# Altium schematic sheet Scooter - Primary Board - Schematic.SchDoc: PIC
size A3; PageSetup: Record=PageOptions|CenterHorizontal=True|CenterVertical=True|PrintScale=1.01|XCorrection=1.00|YCorrection=1.00|PrintKind=1|BorderSize=5000000|LeftOffset=0|BottomOffset=0|Orientation=2|PaperLength=1000|PaperWidth=1000|Scale=100|PaperSource=15|PrintQuality=600|MediaType=1|DitherType=10|PaperKind=A3|PrintScaleMode=1
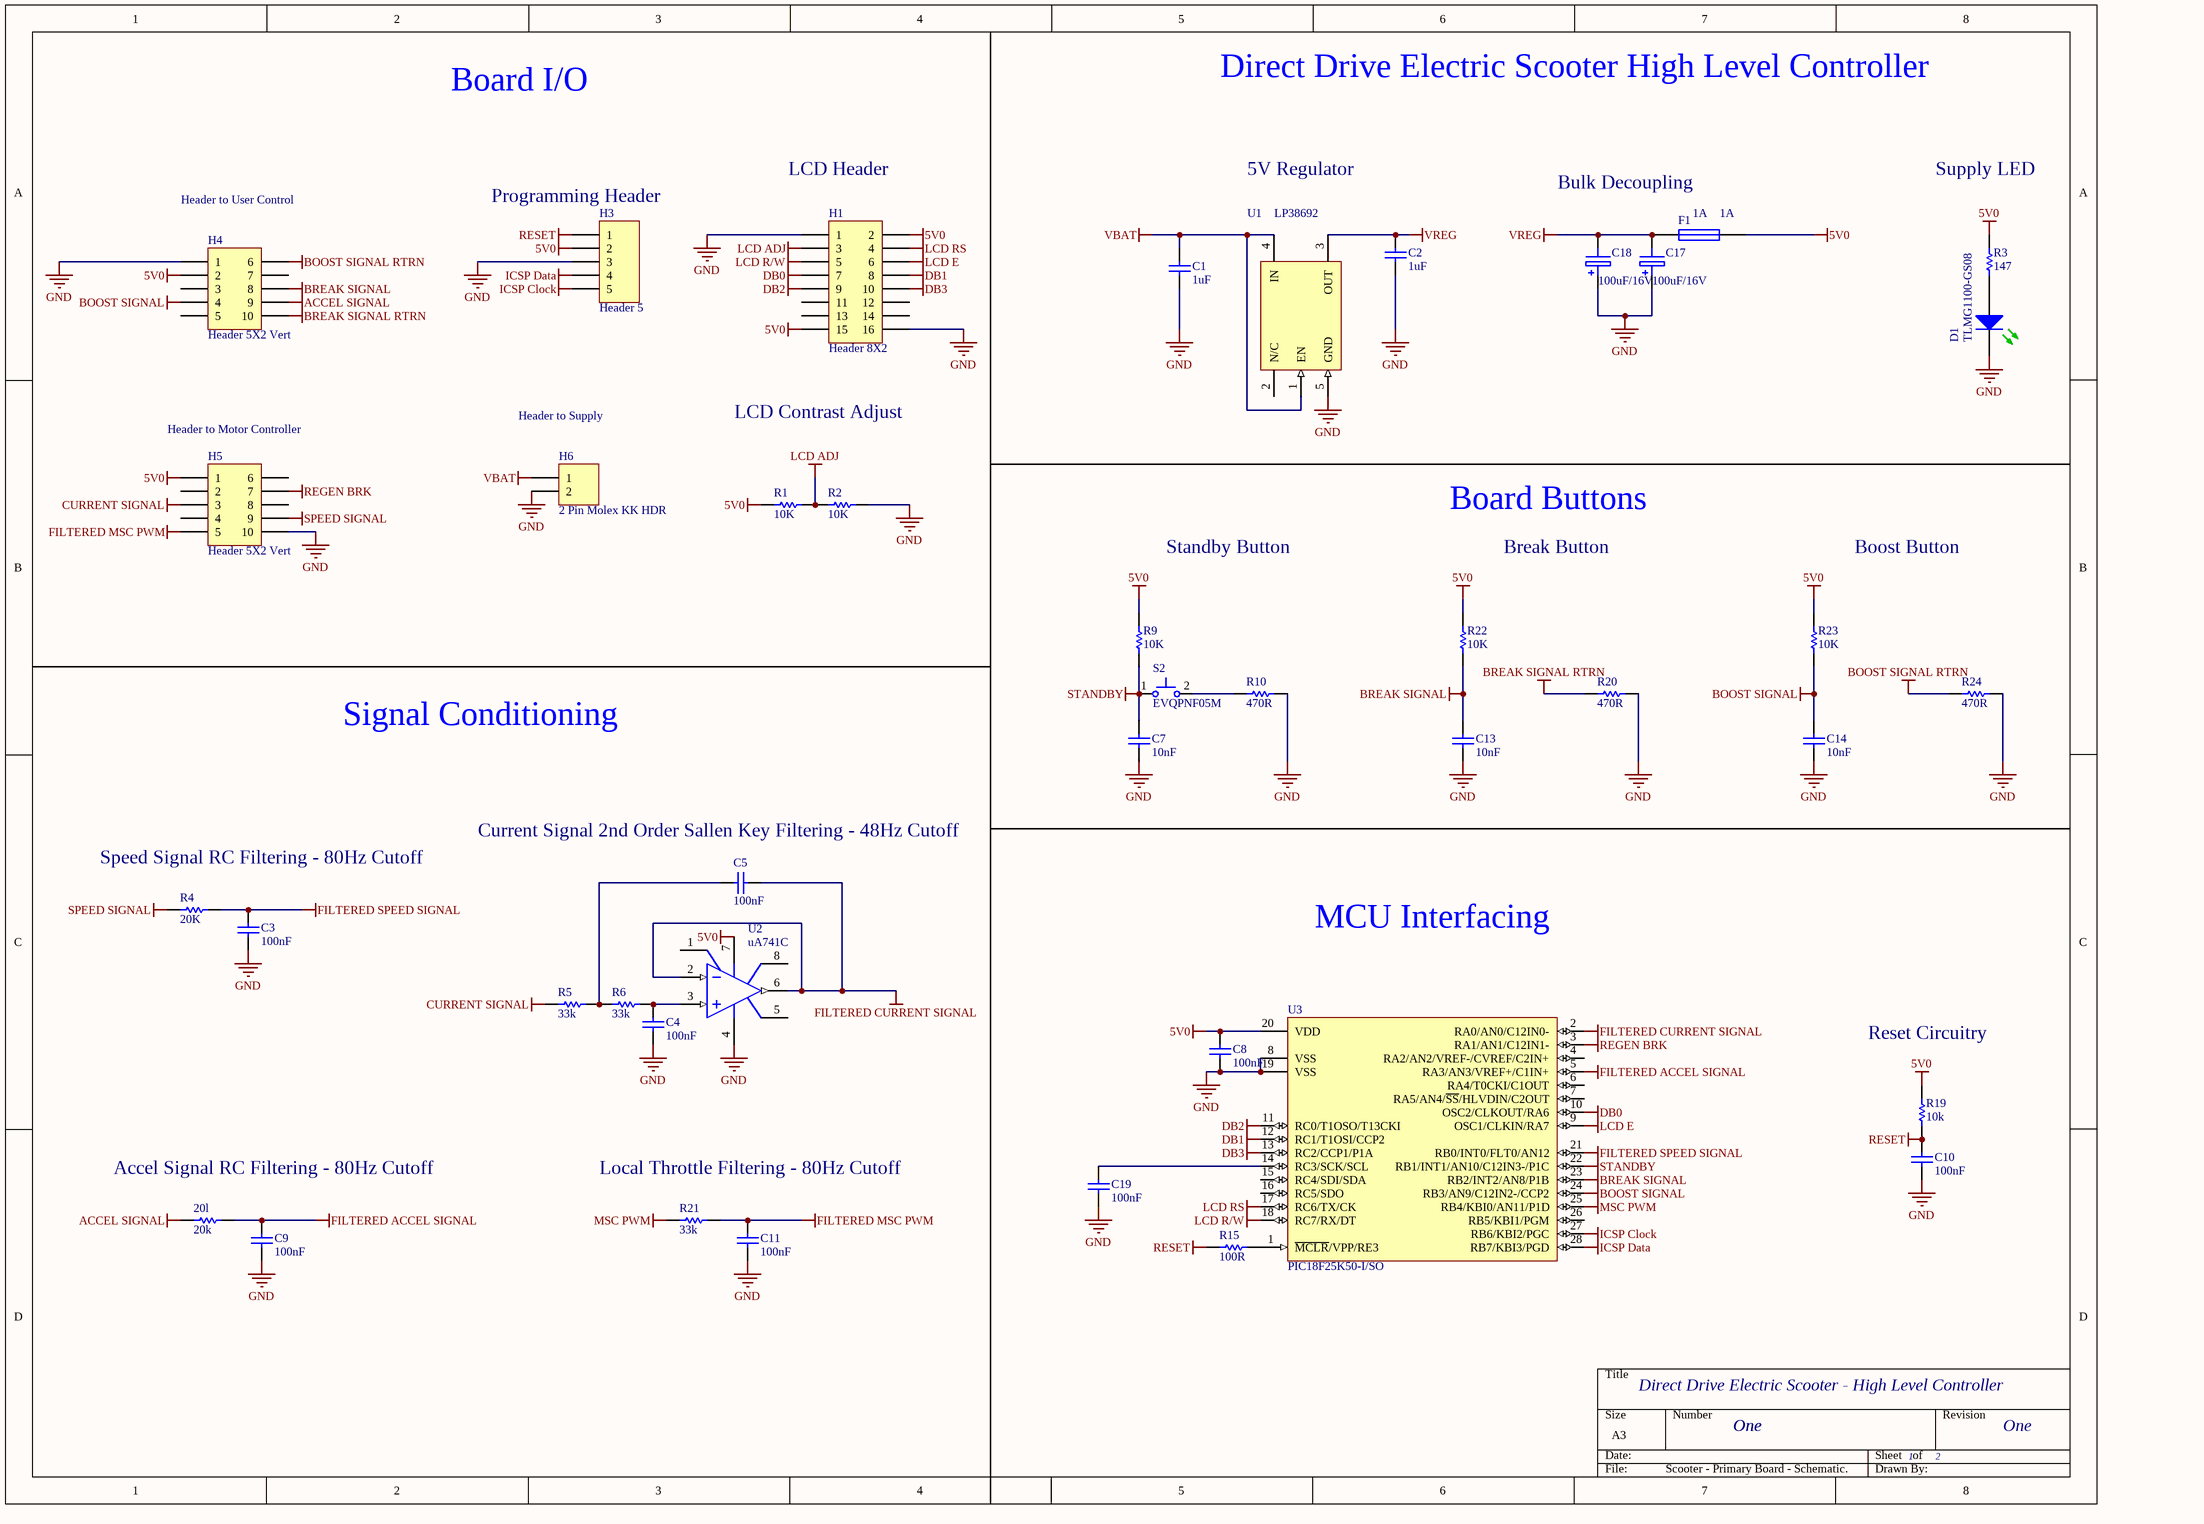
[diagram p0: Scooter - Primary Board - Schematic.SchDoc]

## Parts
20l  20k  [RESC1608L]
C1  1uF  [CAPC1608L]
C2  1uF  [CAPC1608L]
C3  100nF  [CAPC1608L]
C4  100nF  [CAPC1608L]
C5  100nF  [CAPC1608L]
C7  10nF  [CAPC1608L]
C8  100nF  [CAPC1608L]
C9  100nF  [CAPC1608L]
C10  100nF  [CAPC1608L]
C11  100nF  [CAPC1608L]
C13  10nF  [CAPC1608L]
C14  10nF  [CAPC1608L]
C17  100uF/16V  [NICH-1]
C18  100uF/16V  [NICH-1]
C19  100nF  [CAPC1608L]
D1  TLMG1100-GS08  [LED0.8X1.6]
F1  1A  [RESC3216N]
H1  Header 8X2  [HDR2X8]
H3  Header 5  [HDR1X5]
H4  Header 5X2 Vert  [IDC2.54-V10D]
H5  Header 5X2 Vert  [IDC2.54-V10D]
H6  2 Pin Molex KK HDR  [MOLEX_KK_2_HDR]
R1  10K  [RESC1608L]
R2  10K  [RESC1608L]
R3  147  [RESC1608L]
R4  20K  [RESC1608L]
R5  33k  [RESC1608L]
R6  33k  [RESC1608L]
R9  10K  [RESC1608L]
R10  470R  [RESC1608L]
R15  100R  [RESC1608L]
R19  10k  [RESC1608L]
R20  470R  [RESC1608L]
R21  33k  [RESC1608L]
R22  10K  [RESC1608L]
R23  10K  [RESC1608L]
R24  470R  [RESC1608L]
S2  EVQPNF05M  [EVQPNF05M]
U1  LP38692  [SOT223-5N]
U2  uA741C  [SO8_N]
U3  PIC18F25K50-I/SO  [SOIC-SO28_N]

## Nets
5V0: C8.2 F1.2 H1.2 H1.15 H3.2 H4.2 H5.1 R1.2 R3.2 R9.2 R19.2 R22.2 R23.2 U2.7(V+) U3.20(VDD)
ACCEL SIGNAL: 20l.2 H4.9
BOOST SIGNAL: C14.2 H4.4 R23.1 U3.24(RB3/AN9/C12IN2-/CCP2)
BOOST SIGNAL RTRN: H4.6 R24.1
BREAK SIGNAL: C13.1 H4.8 R22.1 U3.23(RB2/INT2/AN8/P1B)
BREAK SIGNAL RTRN: H4.10 R20.1
CURRENT SIGNAL: H5.3 R5.2
DB0: H1.7 U3.10(OSC2/CLKOUT/RA6)
DB1: H1.8 U3.12(RC1/T1OSI/CCP2)
DB2: H1.9 U3.11(RC0/T1OSO/T13CKI)
DB3: H1.10 U3.13(RC2/CCP1/P1A)
FILTERED ACCEL SIGNAL: 20l.1 C9.2 U3.5(RA3/AN3/VREF+/C1IN+)
FILTERED CURRENT SIGNAL: C5.1 U2.2(IN-) U2.6(OUT) U3.2(RA0/AN0/C12IN0-)
FILTERED MSC PWM: C11.2 H5.5 R21.1
FILTERED SPEED SIGNAL: C3.2 R4.1 U3.21(RB0/INT0/FLT0/AN12)
GND: C1.1 C2.1 C3.1 C4.1 C7.1 C8.1 C9.1 C10.1 C11.1 C13.2 C14.1 C17.2 C18.2 C19.1 D1.2(K) H1.1 H1.16 H3.3 H4.1 H5.10 H6.2 R2.1 R10.2 R20.2 R24.2 U1.5(GND) U2.4(V-) U3.8(VSS) U3.19(VSS)
ICSP Clock: H3.5 U3.27(RB6/KBI2/PGC)
ICSP Data: H3.4 U3.28(RB7/KBI3/PGD)
LCD ADJ: H1.3 R1.1 R2.2
LCD E: H1.6 U3.9(OSC1/CLKIN/RA7)
LCD R/W: H1.5 U3.18(RC7/RX/DT)
LCD RS: H1.4 U3.17(RC6/TX/CK)
MSC PWM: R21.2 U3.25(RB4/KBI0/AN11/P1D)
REGEN BRK: H5.7 U3.3(RA1/AN1/C12IN1-)
RESET: C10.2 H3.1 R15.1 R19.1
SPEED SIGNAL: H5.9 R4.2
STANDBY: C7.2 R9.1 S2.1 U3.22(RB1/INT1/AN10/C12IN3-/P1C)
VBAT: C1.2 H6.1 U1.1(EN) U1.4(IN)
VREG: C2.2 C17.1 C18.1 F1.1 U1.3(OUT)
NetC4_2: C4.2 R6.1 U2.3(IN+)
NetC5_2: C5.2 R5.1 R6.2
NetC19_2: C19.2 U3.14(RC3/SCK/SCL)
NetD1_1: D1.1(A) R3.1
NetR10_1: R10.1 S2.2
NetR15_2: R15.2 U3.1(~{MCLR}/VPP/RE3)

Not connected (* = marked no-connect by the designer): H1 11 12 13 14; H4 3 5 7; H5 2 4 6 8; U1 2(N/C); U2 1(BAL1/CMPEN) 5(BAL2) 8(CMPEN); U3 4(RA2/AN2/VREF-/CVREF/C2IN+) 6(RA4/T0CKI/C1OUT) 7(RA5/AN4/~{SS}/HLVDIN/C2OUT) 15(RC4/SDI/SDA) 16(RC5/SDO) 26(RB5/KBI1/PGM)

## Notes on the sheet
- Board I/O
- Direct Drive Electric Scooter High Level Controller
- LCD Header
- 5V Regulator
- Supply LED
- Header to User Control
- (near H3) Programming Header
- Bulk Decoupling
- (near H5) Header to Motor Controller
- Header to Supply
- LCD Contrast Adjust
- Board Buttons
- Standby Button
- Break Button
- Boost Button
- Signal Conditioning
- (near C5) Current Signal 2nd Order Sallen Key Filtering - 48Hz Cutoff
- Speed Signal RC Filtering - 80Hz Cutoff
- MCU Interfacing
- Reset Circuitry
- Accel Signal RC Filtering - 80Hz Cutoff
- Local Throttle Filtering - 80Hz Cutoff
- Direct Drive Electric Scooter - High Level Controller
- One
- 1
- 2

## Library data of the parts
20l R1-R6 R9 R21-R23 = RS_10K: RES 10.0K OHM 1/10W 5% 0603 SMD; Storage Location: ProtoPlace; Supplier: ECE Dept Stock
  20l: Value: 20k
  R1 R2 R9 R22 R23: Value: 10K
  R3: Value: 147
  R4: Value: 20K
  R5 R6 R21: Value: 33k
C1 C2 = CC_1uF_0603: CAP CER 1uF Y5V -20% +80% 16V 0603; PackageReference: 0603; Code_IPC: 1608 [0603]; Verify: *; Supplier: ECE Dept Stock; Storage Location: Pottle; Value: 1uF
C3-C5 C8-C10 C19 = CC_100nF_0603: CAP CER 100nF X7R +-10% 50V 0603; PackageReference: 0603; Code_IPC: 1608 [0603]; Verify: *; Supplier: ECE Dept Stock; Storage Location: Pottle; Value: 100nF
C7 C13 C14 = CC_10nF_0603: CAP CER 10nF X7R +-10% 50V 0603; PackageReference: 0603; Code_IPC: 1608 [0603]; Verify: *; Supplier: ECE Dept Stock; Storage Location: Pottle; Value: 10nF
C11 = CC_220nF_0603: CAP CER 220nF Y5V -20% +80% 16V 0603; PackageReference: 0603; Code_IPC: 1608 [0603]; Verify: *; Supplier: ECE Dept Stock; Storage Location: Pottle; Value: 100nF
C17 C18 = CA_100uF_16V_SMD: Nichcon WX series  SMT Aluminium Electrolytic Cap; Manufacturer PN: UWX1C101MCL1GB; Value: 100uF @ 16V; Manufacturer: Nichcon; Supplier 1: ECE Stock
D1 = DL_TLMG1100: LED Green 0603; Manufacturer: Vishay Semiconductor Opto Division; Millicandela Rating: 35mcd; Voltage - Forward (Vf) Typ: 2.1V; Viewing Angle: 160°; Wavelength - Peak: 572nm; Supplier 1: Farnell; Supplier 2: Digi-Key; Color: Green; Package / Case: 0603 (1608 Metric); Packaging: Cut Tape (CT); Size / Dimension: 1.60mm L x 0.80mm W; Pricing: 1=0.67, 10=0.525, 25=0.4376, 100=0.359, 250=0.29912, 500=0.24852, 1000=0.18408 (NZD); Supplier Part Number 1: 2293494; Supplier Part Number 2: 751-1165-1-ND; Manufacturer Part Number: TLMG1100-GS08
F1 = FS_Fuse_1.0A_SMD_1206: Fuse 1.0A Very Fast Acting 1206; Manufacturer: Multicomp; Manufacturer PN: MC12CF 001; Supplier: Lab Stock; Storage Location: *; Value: 1A
H1 = Header 8X2: Header, 8-Pin, Dual row; LatestRevisionDate: 17-Jul-2002; LatestRevisionNote: Re-released for DXP Platform.; Publisher: Altium Limited
H3 = Header 5: Header, 5-Pin; LatestRevisionDate: 17-Jul-2002; LatestRevisionNote: Re-released for DXP Platform.; Publisher: Altium Limited
H4 H5 = JA_HDR_IDC_5X2_VERT: IDC Header, 2,54mm, 10-Pin, Vert; Supplier: ECE Dept Store
H6 = JA_MOLEX_KK_2POS: CONN HEADER 2POS 2.54mm VERT_Thru Hole; Supplier 1: Farnell; Supplier Part Number 1: 1462926; Supplier 2: ECE Store; Value: 2 Pin Molex KK HDR
R10 R15 R19 R20 R24 = RS_470R: RES 470 OHM 1/10W 5% 0603 SMD; Storage Location: ProtoPlace; Supplier: ECE Dept Stock
  R10 R20 R24: Value: 470R
  R15: Value: 100R
  R19: Value: 10k
S2 = WS_EVQPNF05M: Panasonic 6 x 3.5mm SMD Light Touch Switch Type; PackageDescription: 6.0 x 3.5 mm; Supplier 1: Farnell; Supplier Part Number 1: 2079481; Manufacturer: Panasonic; Manufacturer PN: EVQPNF05M
U1 = MCP1826-ADJE/AT: 1000 mA, Low Voltage, Low Quiescent Current LDO Regulator, 5-Pin TO-220, Extended Temperature; Published: 29-Jan-2009; DatasheetVersion: revA, Aug-2007; PackageVersion: revBB, Aug-2009; PackageReference: TO-220-AT5; Publisher: Altium Limited; PackageDescription: 5-Lead Plastic Transistor Outline (AT) [TO-220]; Supplier 1: Digi-Key; Supplier Part Number 1: MCP1826-ADJE/AT-ND; Supplier 2: Farnell; Supplier Part Number 2: 1578415; ComponentLink1Description: Datasheet; ComponentLink1URL: http://ww1.microchip.com/downloads/en/DeviceDoc/22057a.pdf; ComponentLink2Description: Packaging Specification; ComponentLink2URL: http://www.microchip.com/stellent/groups/techpub_sg/documents/packagingspec/en012702.pdf; ComponentLink3Description: Microchip.com Home; ComponentLink3URL: http://www.microchip.com/
U2 = LM101AJG: High Performance Operational Amplifier; ComponentAvailability: Obsolete; Published: 16-Jan-2001; LatestRevisionDate: 04-Mar-2005; LatestRevisionNote: Stylized 3D Model Added.; DatasheetVersion: Sep-1990; PackageVersion: Jan-1995; PackageReference: JG008; Publisher: Altium Limited; PackageDescription: DIP; 8 Leads; Row Spacing 7.62 mm; Pitch 2.54 mm; ComponentLink1Description: Manufacturer Link; ComponentLink1URL: http://www.ti.com/; ComponentLink2Description: Datasheet; ComponentLink2URL: http://focus.ti.com/lit/ds/slos061/slos061.pdf; ComponentLink3Description: Discontinuation Notice; ComponentLink3URL: http://focus.ti.com/pdfs/mltry/obsolete.pdf
U3 = PIC18F25K20T-I/SO: Flash Microcontroller with 10-Bit A/D and nanoWatt Technology, 32K Flash, 28-Pin SOIC, Industrial Temperature Range, Tape and Reel; Published: 29-Jan-2009; LatestRevisionDate: 02-Dec-2009; LatestRevisionNote: Updated to datasheet revision F, Sep-2009; DatasheetVersion: revF, Sep-2009; PackageVersion: revBB, Aug-2009; PackageReference: SOIC-SO28; Publisher: Altium Limited; PackageDescription: 28-Lead Plastic Small Outline (SO) - Wide 7.50mm Body [SOIC]; Supplier 1: Digi-Key; Supplier Part Number 1: PIC18F25K20T-I/SOTR-ND; Code_JEDEC: MS-013; ComponentLink1Description: Datasheet; ComponentLink1URL: http://ww1.microchip.com/downloads/en/DeviceDoc/41303F.pdf; ComponentLink2Description: Packaging Specification; ComponentLink2URL: http://www.microchip.com/stellent/groups/techpub_sg/documents/packagingspec/en012702.pdf; ComponentLink3Description: Microchip.com Home; ComponentLink3URL: http://www.microchip.com/